# EAGLE schematic 1hp_blank (EAGLE 7.7.0)
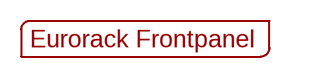
[diagram p0: schematic, sheet 1]

## Parts
U$1  EURORACK_PANEL1HP  [EURORACK1HPPANEL]

## Library data of the parts
U$1 = EurorackModularParts:EURORACK_PANEL